# EAGLE design motor_driver_LM5107 (EAGLE 6.5.0)
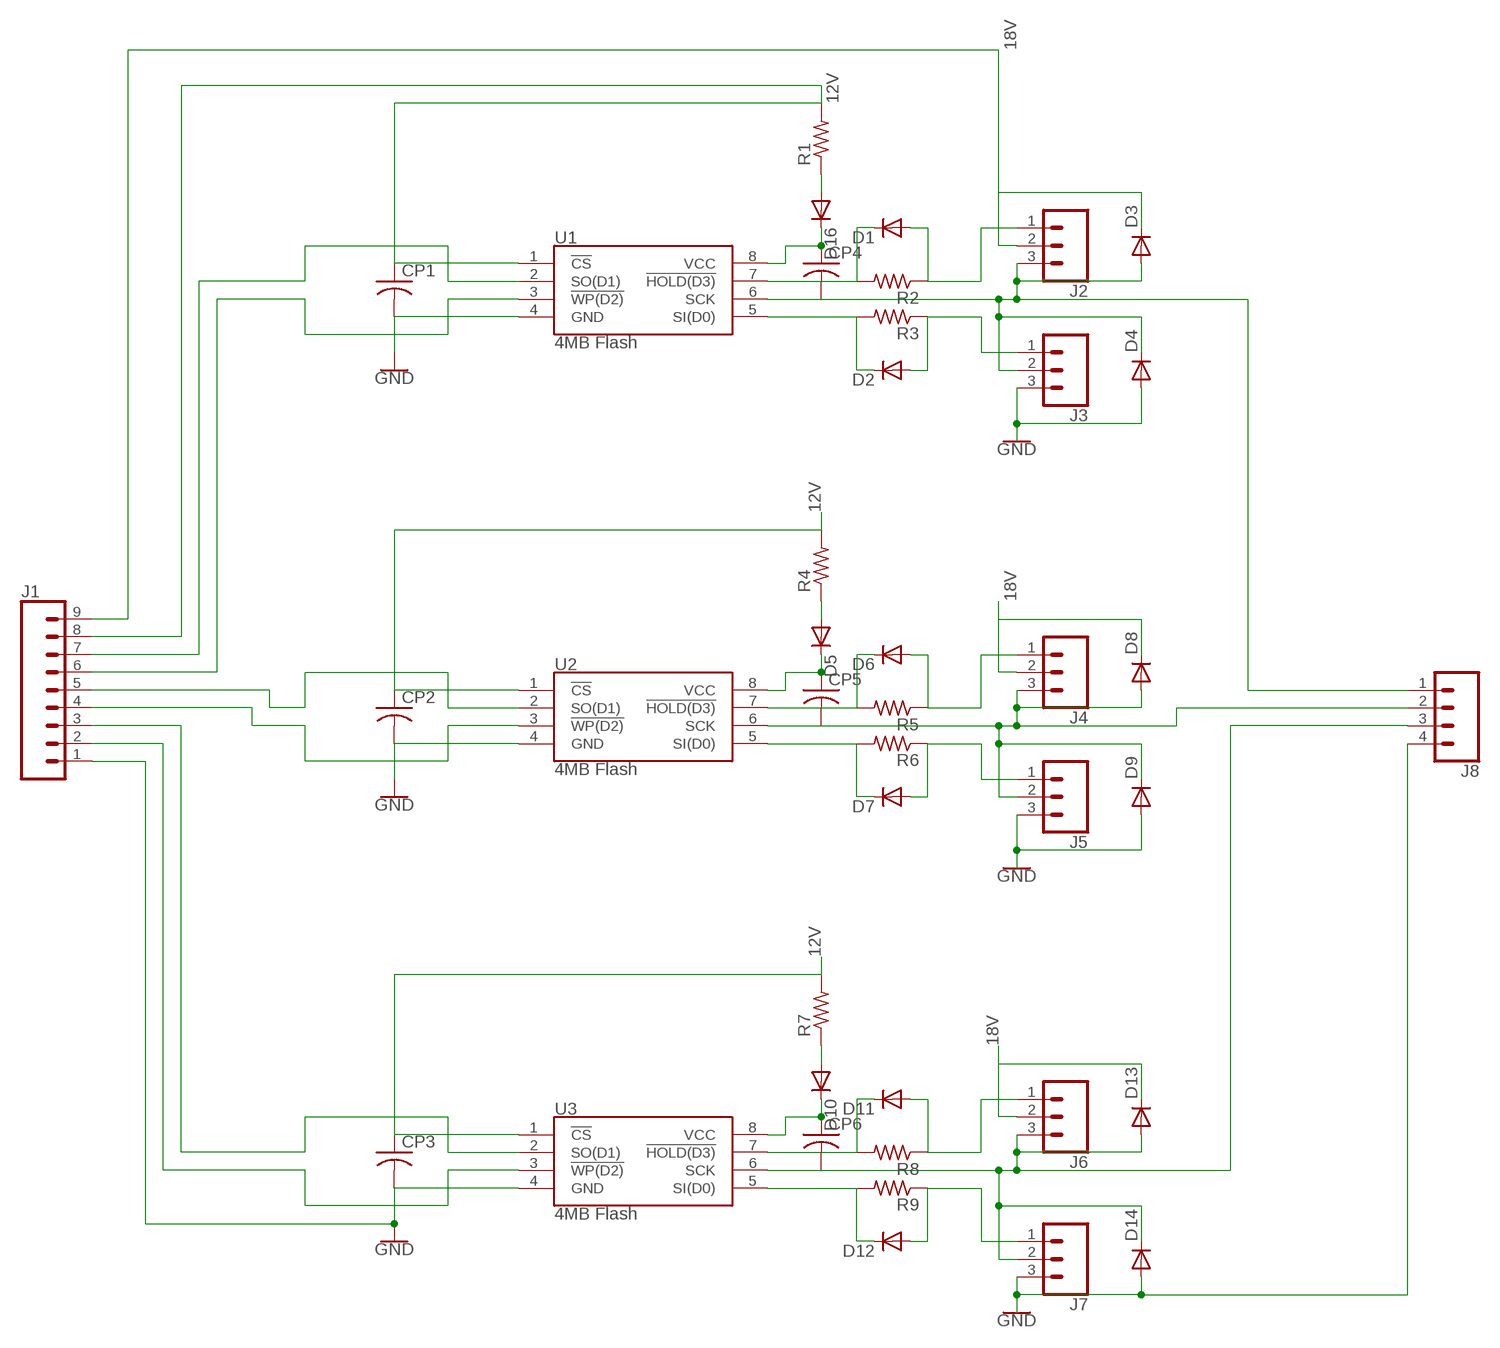
[diagram p0: schematic, sheet 1]

## Parts
CP1  C-US025-024X044  [C025-024X044]
CP2  C-US025-024X044  [C025-024X044]
CP3  C-US025-024X044  [C025-024X044]
CP4  C-US025-024X044  [C025-024X044]
CP5  C-US025-024X044  [C025-024X044]
CP6  C-US025-024X044  [C025-024X044]
D1  DIODE-D-5  [D-5]
D2  DIODE-D-5  [D-5]
D3  DIODE-D-5  [D-5]
D4  DIODE-D-5  [D-5]
D5  DIODE-D-5  [D-5]
D6  DIODE-D-5  [D-5]
D7  DIODE-D-5  [D-5]
D8  DIODE-D-5  [D-5]
D9  DIODE-D-5  [D-5]
D10  DIODE-D-5  [D-5]
D11  DIODE-D-5  [D-5]
D12  DIODE-D-5  [D-5]
D13  DIODE-D-5  [D-5]
D14  DIODE-D-5  [D-5]
D16  DIODE-D-5  [D-5]
J1  CONN_09  [1X09]
J2  CONN_03LOCK  [1X03_LOCK]
J3  CONN_03LOCK  [1X03_LOCK]
J4  CONN_03LOCK  [1X03_LOCK]
J5  CONN_03LOCK  [1X03_LOCK]
J6  CONN_03LOCK  [1X03_LOCK]
J7  CONN_03LOCK  [1X03_LOCK]
J8  CONN_04  [1X04]
R1  R-US_0204/5  [0204/5]
R2  R-US_0204/5  [0204/5]
R3  R-US_0204/5  [0204/5]
R4  R-US_0204/5  [0204/5]
R5  R-US_0204/5  [0204/5]
R6  R-US_0204/5  [0204/5]
R7  R-US_0204/5  [0204/5]
R8  R-US_0204/5  [0204/5]
R9  R-US_0204/5  [0204/5]
U1  4MB Flash  AT25SF041  [SO08]
U2  4MB Flash  AT25SF041  [SO08]
U3  4MB Flash  AT25SF041  [SO08]

## Nets
12V: CP1.1 CP2.1 CP3.1 J1.8 R1.2 R4.2 R7.2 U1.1(!CS) U2.1(!CS) U3.1(!CS)
18V: D3.C D8.C D13.C J1.9 J2.2 J4.2 J6.2
GND: CP1.2 CP2.2 CP3.2 D4.A D9.A D14.A J1.1 J3.3 J5.3 J7.3 J8.4 U1.4(GND) U2.4(GND) U3.4(GND)
N$1: D16.A R1.1
N$2: CP4.1 D16.C U1.8(VCC)
N$3: D1.C R2.2 U1.7(!HOLD(D3))
N$4: CP4.2 D3.A D4.C J2.3 J3.2 J8.1 U1.6(SCK)
N$7: J1.7 U1.2(SO(D1))
N$8: J1.6 U1.3(!WP(D2))
N$9: D2.C R3.2 U1.5(SI(D0))
N$10: D1.A J2.1 R2.1
N$11: D2.A J3.1 R3.1
N$15: D5.A R4.1
N$16: CP5.1 D5.C U2.8(VCC)
N$17: CP5.2 D8.A D9.C J4.3 J5.2 J8.2 U2.6(SCK)
N$19: J1.5 U2.2(SO(D1))
N$20: J1.4 U2.3(!WP(D2))
N$21: D6.C R5.2 U2.7(!HOLD(D3))
N$22: D7.C R6.2 U2.5(SI(D0))
N$23: D6.A J4.1 R5.1
N$24: D7.A J5.1 R6.1
N$26: D10.A R7.1
N$27: CP6.1 D10.C U3.8(VCC)
N$28: CP6.2 D13.A D14.C J6.3 J7.2 J8.3 U3.6(SCK)
N$30: J1.3 U3.2(SO(D1))
N$31: J1.2 U3.3(!WP(D2))
N$32: D11.C R8.2 U3.7(!HOLD(D3))
N$33: D12.C R9.2 U3.5(SI(D0))
N$34: D11.A J6.1 R8.1
N$35: D12.A J7.1 R9.1

## Library data of the parts
CP1-CP6 = resistor:C-US: CAPACITOR, American symbol
D1-D14 D16 = diode:DIODE-: DIODE
J1 = SparkFun-Connectors:CONN_09: Multi connection point. Often used as Generic Header-pin footprint for 0.1 inch spaced/style header connections On any of the 0.1 inch spaced packages, you can populate with these: Break Away Headers - Straight <https://www.sparkfun.com/products/116> (PRT-00116) Break Away Male Headers - Right Angle <https://www.sparkfun.com/products/553> (PRT-00553) Female Headers <https://www.sparkfun.com/products/115> (PRT-00115) Break Away Headers - Machine Pin <https://www.sparkfun.com/products/117> (PRT-00117) Break Away Female Headers - Swiss Machine Pin <https://www.sparkfun.com/products/743> (PRT-00743) For SCREWTERMINALS and SPRING TERMINALS visit here: Screw Terimnals on SparkFun.com <https://www.sparkfun.com/search/results?term=Screw+Terminals> (5mm/3.5mm/2.54mm spacing) This device is also useful as a general connection point to wire up your design to another part of your project. Our various solder wires solder well into these plated through hole pads. Hook-Up Wire - Assortment (Stranded, 22 AWG) <https://www.sparkfun.com/products/11375> (PRT-11375) Hook-Up Wire - Assortment (Solid Core, 22 AWG) <https://www.sparkfun.com/products/11367> (PRT-11367) View the entire wire category on our website here <https://www.sparkfun.com/categories/141> Special notes: Molex polarized connector foot print use with SKU : PRT-08231 with associated crimp pins and housings. 1MM SMD Version SKU: PRT-10208 NOTES ON THE VARIANTS LOCK and LOCK_LONGPADS... This footprint was designed to help hold the alignment of a through-hole component (i.e. 6-pin header) while soldering it into place. You may notice that each hole has been shifted either up or down by 0.005 of an inch from it's more standard position (which is a perfectly straight line). This slight alteration caused the pins (the squares in the middle) to touch the edges of the holes. Because they are alternating, it causes a "brace" to hold the component in place. 0.005 has proven to be the perfect amount of "off-center" position when using our standard breakaway headers. Although looks a little odd when you look at the bare footprint, once you have a header in there, the alteration is very hard to notice. Also,if you push a header all the way into place, it is covered up entirely on the bottom side.
J2-J7 = SparkFun-Connectors:CONN_03: Multi connection point. Often used as Generic Header-pin footprint for 0.1 inch spaced/style header connections On any of the 0.1 inch spaced packages, you can populate with these: Break Away Headers - Straight <https://www.sparkfun.com/products/116> (PRT-00116) Break Away Male Headers - Right Angle <https://www.sparkfun.com/products/553> (PRT-00553) Female Headers <https://www.sparkfun.com/products/115> (PRT-00115) Break Away Headers - Machine Pin <https://www.sparkfun.com/products/117> (PRT-00117) Break Away Female Headers - Swiss Machine Pin <https://www.sparkfun.com/products/743> (PRT-00743) Stackable Header - 3 Pin (Female, 0.1") <https://www.sparkfun.com/products/13875> (PRT-13875) For SCREWTERMINALS and SPRING TERMINALS visit here: Screw Terimnals on SparkFun.com <https://www.sparkfun.com/search/results?term=Screw+Terminals> (5mm/3.5mm/2.54mm spacing) This device is also useful as a general connection point to wire up your design to another part of your project. Our various solder wires solder well into these plated through hole pads. Hook-Up Wire - Assortment (Stranded, 22 AWG) <https://www.sparkfun.com/products/11375> (PRT-11375) Hook-Up Wire - Assortment (Solid Core, 22 AWG) <https://www.sparkfun.com/products/11367> (PRT-11367) View the entire wire category on our website here <https://www.sparkfun.com/categories/141> Special notes: Molex polarized connector foot print use with SKU : PRT-08232 with associated crimp pins and housings.
J8 = SparkFun-Connectors:CONN_04: Multi connection point. Often used as Generic Header-pin footprint for 0.1 inch spaced/style header connections On any of the 0.1 inch spaced packages, you can populate with these: Break Away Headers - Straight <https://www.sparkfun.com/products/116> (PRT-00116) Break Away Male Headers - Right Angle <https://www.sparkfun.com/products/553> (PRT-00553) Female Headers <https://www.sparkfun.com/products/115> (PRT-00115) Break Away Headers - Machine Pin <https://www.sparkfun.com/products/117> (PRT-00117) Break Away Female Headers - Swiss Machine Pin <https://www.sparkfun.com/products/743> (PRT-00743) For SCREWTERMINALS and SPRING TERMINALS visit here: Screw Terimnals on SparkFun.com <https://www.sparkfun.com/search/results?term=Screw+Terminals> (5mm/3.5mm/2.54mm spacing) This device is also useful as a general connection point to wire up your design to another part of your project. Our various solder wires solder well into these plated through hole pads. Hook-Up Wire - Assortment (Stranded, 22 AWG) <https://www.sparkfun.com/products/11375> (PRT-11375) Hook-Up Wire - Assortment (Solid Core, 22 AWG) <https://www.sparkfun.com/products/11367> (PRT-11367) View the entire wire category on our website here <https://www.sparkfun.com/categories/141> Special notes: Molex polarized connector foot print use with SKU : PRT-08231 with associated crimp pins and housings. 1MM SMD Version SKU: PRT-10208; PROD_ID: CONN-09696
R1-R9 = rcl:R-US_: RESISTOR, American symbol
U1-U3 = SparkFun-IC-Memory:AT25SF041: AT25SF041 4Mb Serial Flash Memory 104MHz, SPI, 8-SOIC Datasheet <http://www.adestotech.com/wp-content/uploads/DS-AT25SF041_044.pdf> SparkFun Products: SparkFun ESP8266 Thing <https://www.sparkfun.com/products/13231> SparkFun ESP8266 Thing - Dev Board <https://www.sparkfun.com/products/13711>; PROD_ID: IC-12455

## Board
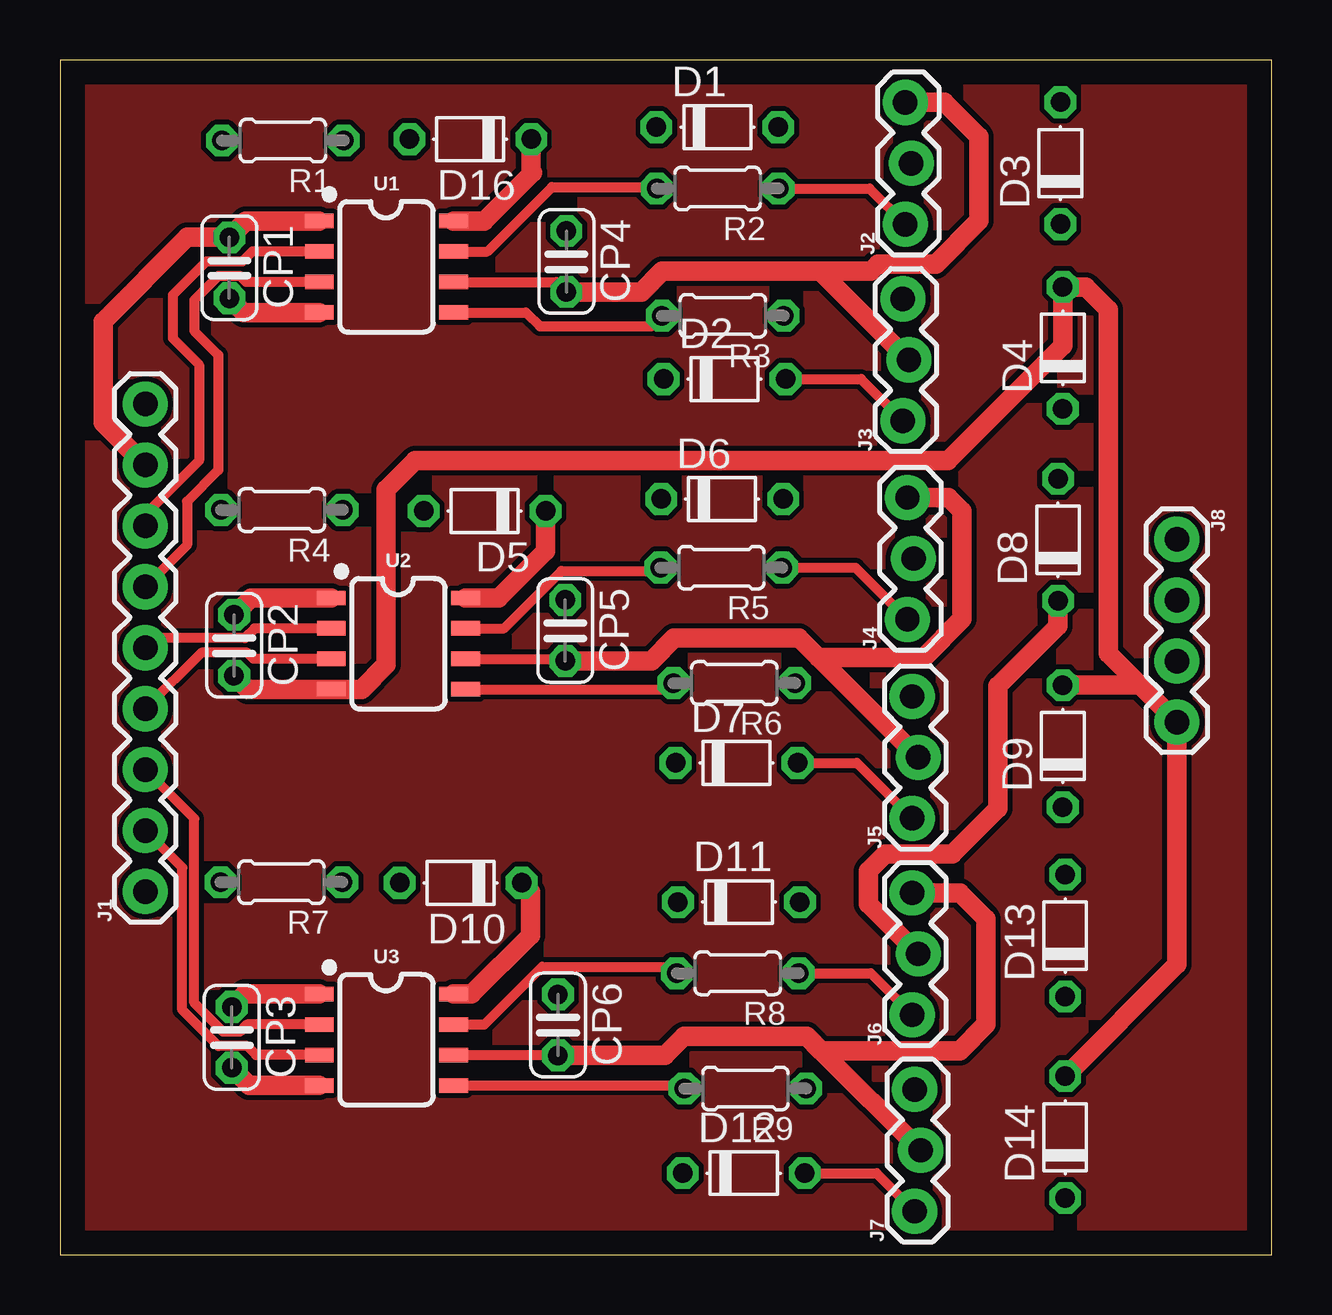
[diagram p1: board, top side]
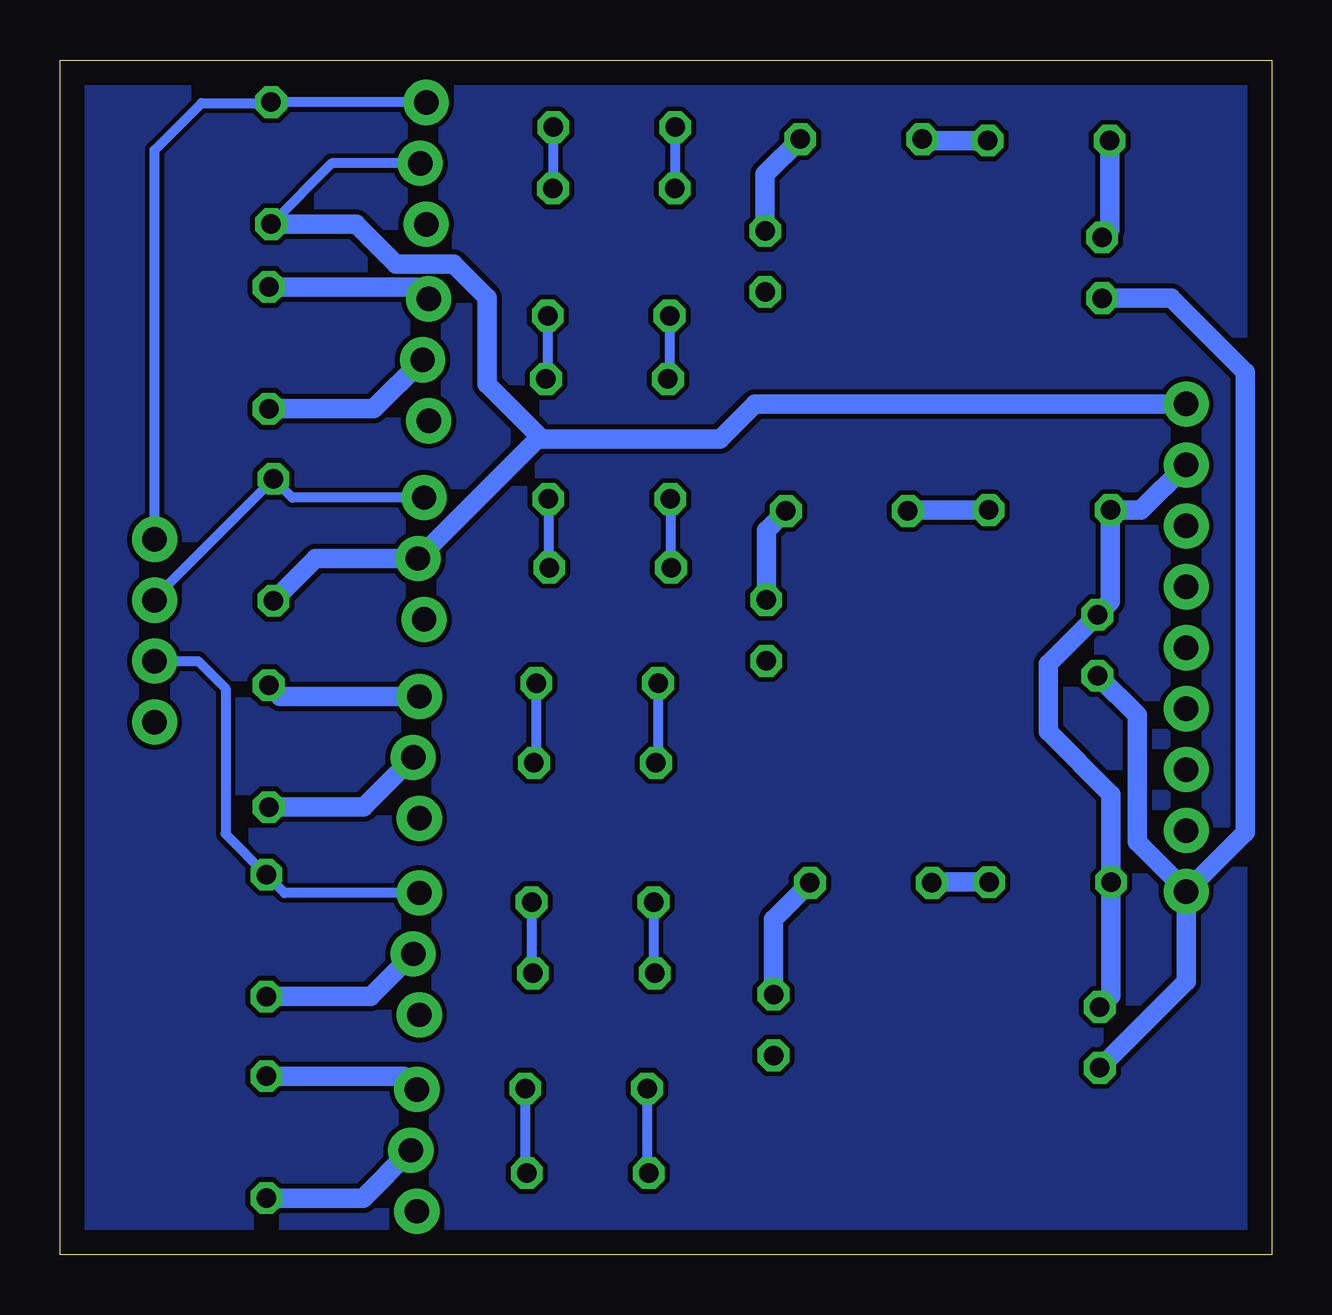
[diagram p2: board, bottom side, seen from below]

Size 50.5 x 49.8 mm. Coordinates in mm from the lower left corner, seen from the top.
Outline: 0,0 50.5,0 50.5,49.8 0,49.8 0,0
Copper layers (1*16): Top 0.035mm / dielectric 1.5mm / Bottom 0.035mm
Design rules "default": minimum track width 10mil, minimum drill 24mil, track to track 8mil, track to pad 8mil, pad to pad 8mil, via to via 8mil, smd to smd 8mil, copper to edge 40mil, drill to drill 8mil, minimum pad ring 10mil, minimum via ring 8mil, stop-mask expansion 4mil, vias tented up to drill 0mil, thermal gap 10mil

### Footprints (pad centres in the part's own frame; a part is rotated, then mirrored left to right if it is on the bottom)
C025-024X044 = drill 0.813 octagon: 1 -1.27,0; 2 1.27,0
D-5 = drill 0.813 octagon: A 2.54,0; C -2.54,0
1X09 = drill 1.016 pad 1.88: 1 0,0; 2 2.54,0; 3 5.08,0; 4 7.62,0; 5 10.16,0; 6 12.7,0; 7 15.24,0; 8 17.78,0; 9 20.32,0
1X03_LOCK = drill 1.016 pad 1.88: 1 0,0.127; 2 2.54,-0.127; 3 5.08,0.127
1X04 = drill 1.016 pad 1.88: 1 0,0; 2 2.54,0; 3 5.08,0; 4 7.62,0
0204/5 = drill 0.813 octagon: 1 -2.54,0; 2 2.54,0
SO08 = smd 0.6 x 1.2: 1 -1.905,-2.8; 2 -0.635,-2.8; 3 0.635,-2.8; 4 1.905,-2.8; 5 1.905,2.8; 6 0.635,2.8; 7 -0.635,2.8; 8 -1.905,2.8

### Placement (x,y rotation side)
CP1  7.06,41.14 270 top
CP2  7.26,25.4 270 top
CP3  7.16,9.06 270 top
CP4  21.11,41.4 270 top
CP5  21.06,26.02 270 top
CP6  20.76,9.58 270 top
D1  27.4,47 0 top
D2  27.7,36.5 0 top
D3  41.7,45.5 90 top
D4  41.8,37.8 90 top
D5  17.7,31 180 top
D6  27.6,31.5 0 top
D7  28.2,20.5 0 top
D8  41.6,29.8 90 top
D9  41.8,21.2 90 top
D10  16.7,15.5 180 top
D11  28.3,14.7 0 top
D12  28.5,3.4 0 top
D13  41.9,13.3 90 top
D14  41.9,4.9 90 top
D16  17.1,46.5 180 top
J1  3.56,15.14 90 top
J2  35.36,42.95 90 top
J3  35.26,34.76 90 top
J4  35.45,26.48 90 top
J5  35.65,18.19 90 top
J6  35.65,10 90 top
J7  35.75,1.81 90 top
J8  46.56,29.82 270 top
R1  9.29,46.44 180 top
R2  27.41,44.44 180 top
R3  27.63,39.14 180 top
R4  9.25,31.04 180 top
R5  27.57,28.64 180 top
R6  28.11,23.83 180 top
R7  9.23,15.53 180 top
R8  28.25,11.73 180 top
R9  28.57,6.93 180 top
U1  13.61,41.18 270 top
U2  14.11,25.47 270 top
U3  13.61,8.96 270 top

### Tracks (layer width: path | path; a pad name or v marks a point on that pad's centre or on a via)
12V
  Top 0.813: U1.1 7.74,43.09 CP1.1 5.31,42.41 1.8,38.9 1.8,34.68 J1.8 | U2.1 7.96,27.38 CP2.1 | U3.1 7.7,10.87 CP3.1
  Bottom 0.813: CP3.1 6.69,10.8 R7.2 6.69,19.19 9.3,21.8 9.3,24.63 CP2.1 6.71,27.22 R4.2 5.44,31.04 J1.8 | R1.2 6.75,42.72 CP1.1
18V
  Top 0.813: D8.C 41.6,26.2 39.1,23.7 39.1,18.6 37.2,16.7 34.4,16.7 33.7,16 33.7,14.62 J6.2
  Bottom 0.406: J2.2 39.17,45.49 D3.C
  Bottom 0.813: D8.C 39.84,29.02 J4.2 30.6,34 30.4,34 | D13.C 37.56,10.76 J6.2 | J1.9 21.54,35.46 23,34 30.4,34 | D3.C 38.16,42.96 36.5,41.3 34.1,41.3 32.7,39.9 32.7,36.3 30.4,34
GND
  Top 0.813: U3.4 7.89,7.05 CP3.2 | CP2.2 7.83,23.57 U2.4 12.56,23.57 13.6,24.6 13.6,31.9 14.8,33.1 37,33.1 41.8,37.9 D4.A 42.76,40.34 43.7,39.4 43.7,25.06 45.02,23.74 | U1.4 7.66,39.27 CP1.2 | D9.A 45.02,23.74 | 45.02,23.74 J8.4 46.56,12.1 D14.A
  Bottom 0.813: J1.1 3.56,11.39 CP3.2 | CP2.2 7.23,24.13 5.6,22.5 5.6,17.2 3.56,15.16 J1.1 | CP1.2 4.17,39.87 1.1,36.8 1.1,17.6 J1.1 | J5.3 41.33,23.27 D9.A | D14.A 36.17,7.44 J7.3 | D4.A 35.63,40.34 J3.3
N$1
  Bottom 0.813: R1.1 14.5,46.44 D16.A
N$2
  Top 0.813: U1.8 17.68,43.09 19.7,45.1 19.64,45.16 D16.C
  Bottom 0.813: D16.C 21.11,45.03 CP4.1
N$3
  Top 0.406: U1.7 17.82,41.81 20.5,44.5 24.81,44.5 R2.2
  Bottom 0.406: D1.C R2.2
N$4
  Top 0.406: U1.6 20.7,40.55 CP4.2
  Top 0.813: CP4.2 24.23,40.13 25.1,41 31.69,41 | 31.69,41 J3.2 | J2.3 36.87,48.03 38.3,46.6 38.3,43.1 36.5,41.3 34.1,41.3 33.8,41 31.69,41
  Bottom 0.406: J2.3 D3.A 41.74,48 44.6,48 46.56,46.04 J8.1
  Bottom 0.813: D4.C 37.43,35.26 J3.2
N$5
  pour Top: 0,50 50.5,50 50.5,0 0,0 0,2 0,49.5
N$6
  pour Bottom: 0,50 50.5,50 50.5,7 50.5,0 0,0 0,2
N$7
  Top 0.406: U1.2 8.02,41.81 7.6,41.4 6.1,41.4 4.7,40 4.7,38.2 5.8,37.1 5.8,33.1 3.56,30.86 J1.7
N$8
  Top 0.406: U1.3 7.75,40.55 7.5,40.8 6.6,40.8 5.6,39.8 5.6,38.5 6.6,37.5 6.6,32.7 5.3,31.4 5.3,29.58 J1.6
N$9
  Top 0.406: U1.5 19.43,39.27 20,38.7 24.65,38.7 R3.2
  Bottom 0.406: R3.2 25.09,36.57 D2.C
N$10
  Top 0.406: R2.1 33.74,44.44 J2.1
  Bottom 0.406: D1.A R2.1
N$11
  Top 0.406: D2.A 33.39,36.5 J3.1
  Bottom 0.406: R3.1 30.17,36.57 D2.A
N$15
  Bottom 0.813: R4.1 15.12,31.04 D5.A
N$16
  Top 0.813: U2.8 18.27,27.38 20.24,29.34 D5.C
  Bottom 0.813: D5.C 21.06,30.18 CP5.1
N$17
  Top 0.406: U2.6 20.98,24.84 CP5.2
  Top 0.813: CP5.2 24.65,24.75 25.6,25.7 30.81,25.7 31.61,24.9 | 31.61,24.9 J5.2 | J4.3 37.04,31.56 37.6,31 37.6,26.5 36,24.9 31.61,24.9
  Bottom 0.406: J4.3 40.82,31.56 D8.A 46.56,27.38 J8.2
  Bottom 0.813: D9.C 37.85,18.66 J5.2
N$19
  Top 0.406: U2.2 8.11,26.11 7.7,25.7 3.96,25.7 J1.5
N$20
  Top 0.406: U2.3 8.06,24.84 7.8,25.1 5.9,25.1 J1.4
N$21
  Top 0.406: U2.7 18.5,26.11 20.9,28.5 24.89,28.5 R5.2
  Bottom 0.406: D6.C 25.06,28.67 R5.2
N$22
  Top 0.406: U2.5 25.3,23.57 R6.2
  Bottom 0.406: R6.2 25.57,20.59 D7.C
N$23
  Top 0.406: R5.1 33.16,28.64 J4.1
  Bottom 0.406: D6.A 30.14,28.67 R5.1
N$24
  Top 0.406: D7.A 33.21,20.5 J5.1
  Bottom 0.406: R6.1 30.65,20.59 D7.A
N$26
  Bottom 0.813: R7.1 14.13,15.53 D10.A
N$27
  Top 0.813: U3.8 17.16,10.87 19.62,13.32 19.62,15.12 D10.C
  Bottom 0.813: D10.C 20.76,13.98 CP6.1
N$28
  Top 0.406: U3.6 20.75,8.32 CP6.2
  Top 0.813: CP6.2 25.21,8.31 26,9.1 31.13,9.1 31.73,8.5 | 31.73,8.5 J7.2 | J6.3 37.52,15.08 38.6,14 38.6,9.6 37.5,8.5 31.73,8.5
  Bottom 0.406: J6.3 41.14,15.08 D13.A 43.6,17.54 43.6,23.6 44.74,24.74 J8.3
  Bottom 0.813: D14.C 37.87,2.36 J7.2
N$30
  Top 0.406: U3.2 7.79,9.6 7.5,9.3 6.8,9.3 5.6,10.5 5.6,18.18 J1.3
N$31
  Top 0.406: U3.3 8.18,8.32 7.8,8.7 6.6,8.7 5.1,10.2 5.1,16.14 J1.2
N$32
  Top 0.406: U3.7 17.7,9.6 20.1,12 25.44,12 R8.2
  Bottom 0.406: D11.C 25.76,11.78 R8.2
N$33
  Top 0.406: U3.5 25.91,7.05 R9.2
  Bottom 0.406: R9.2 26.03,3.47 D12.C
N$34
  Top 0.406: R8.1 33.79,11.73 J6.1
  Bottom 0.406: D11.A 30.84,11.78 R8.1
N$35
  Top 0.406: D12.A 34.03,3.4 J7.1
  Bottom 0.406: R9.1 31.11,3.47 D12.A